# EAGLE board MSP-EXP432P401R_EagleCAD (EAGLE 7.2.0), part 1 of 2
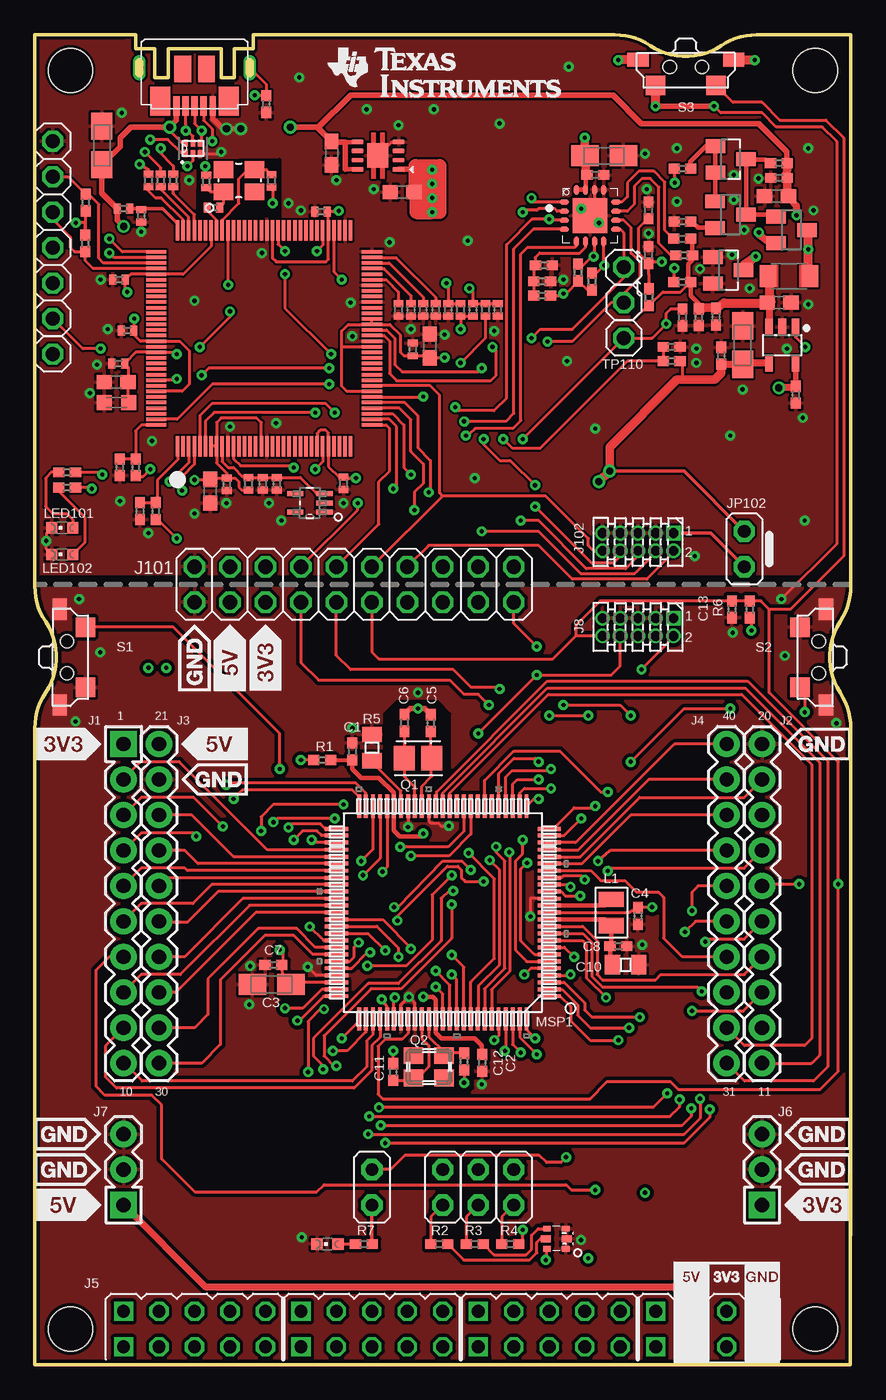
[diagram p6: board, top side]
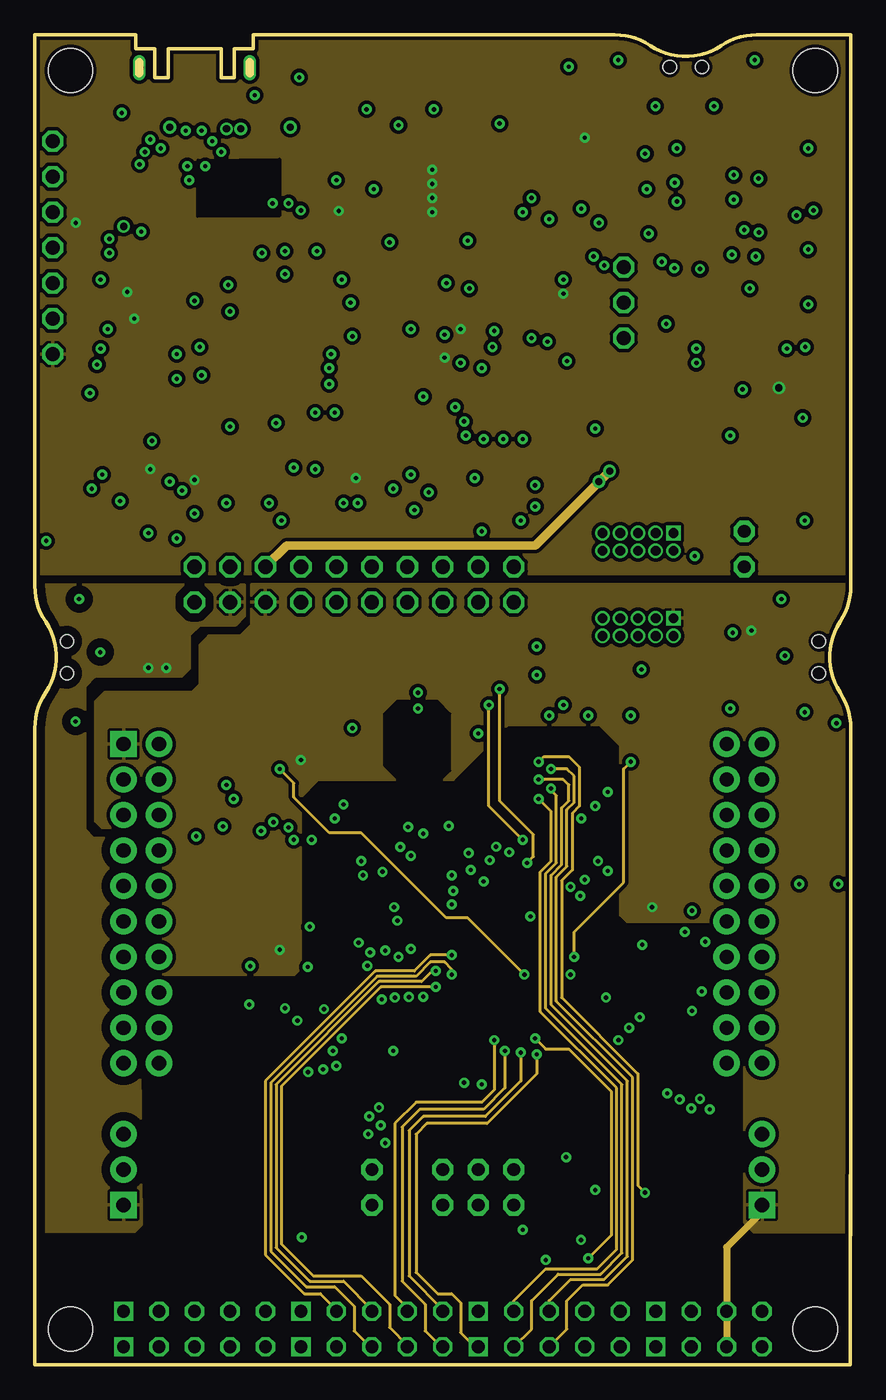
[diagram p7: board, inner layer Mid-Top]
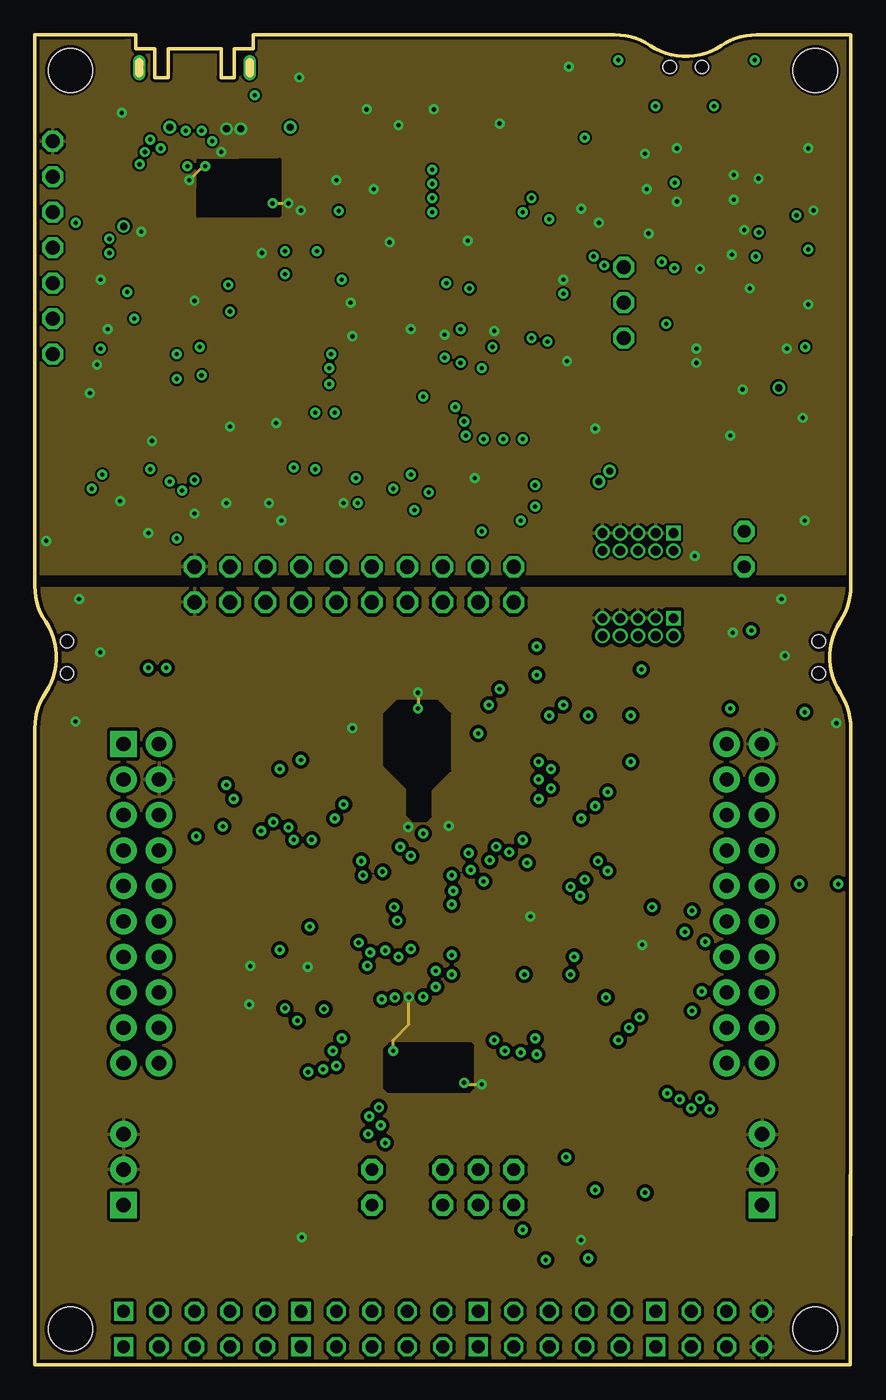
[diagram p8: board, inner layer Mid-Bottom]
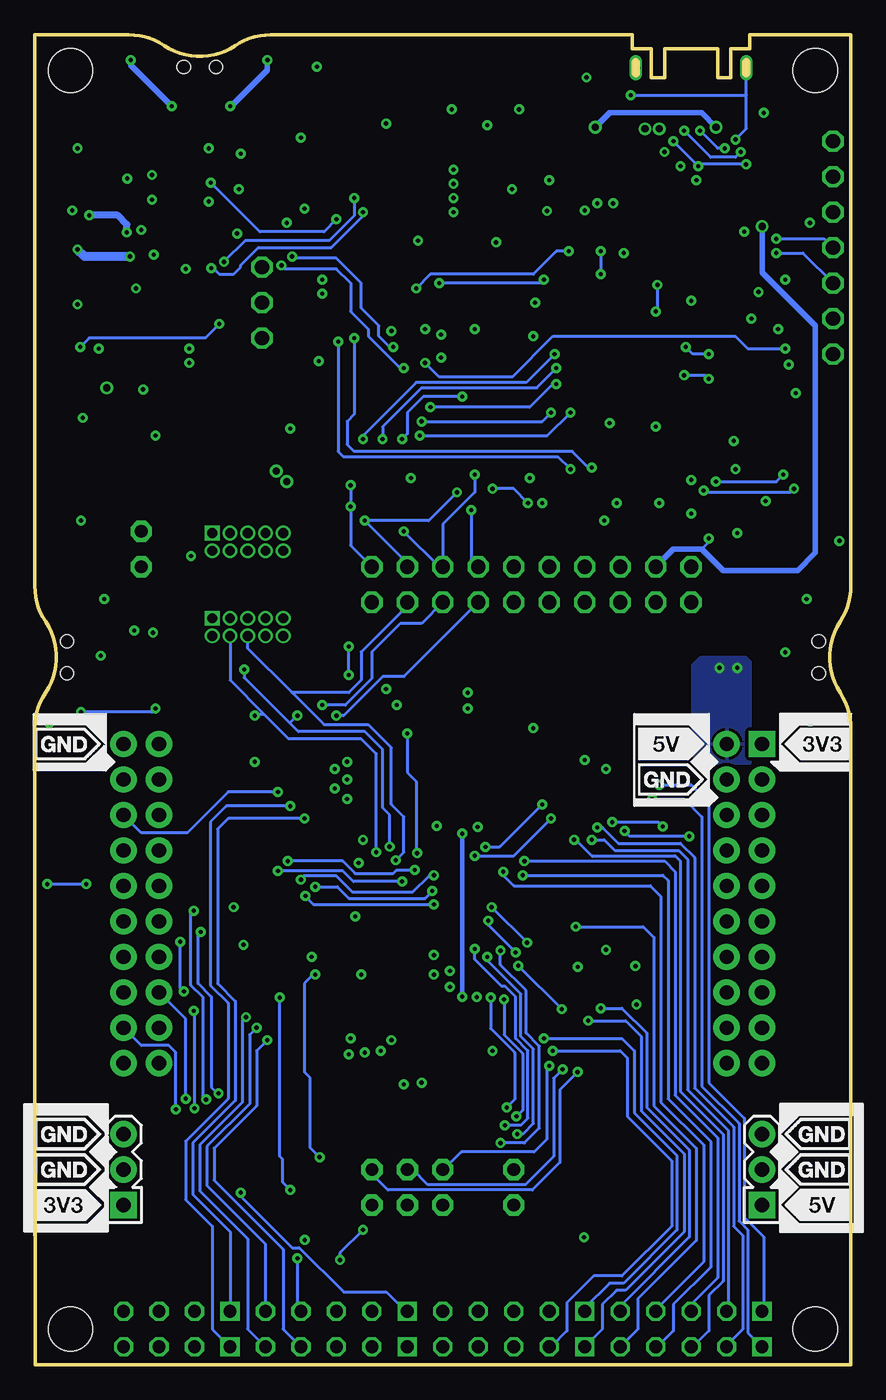
[diagram p9: board, bottom side, seen from below]

Size 58.42 x 95.25 mm. Coordinates in mm from the lower left corner, seen from the top.
Outline: 58.42,27.3 58.39,0 0,0 0,45.59 arc-33 0.76,48.13 arc67 0.76,53.21 arc-33 0,55.75 0,95.25 6.35,95.25
Outline: 58.42,9.27 58.42,45.59 arc33 57.66,48.13 arc-67 57.66,53.21 arc33 58.42,55.75 58.42,95.25 51.69,95.25 arc33 49.15,94.49 arc-67 44.07,94.49 arc33 41.53,95.25 16.51,95.25
Copper layers (1+2*15+16): Top 0.0178mm / dielectric 12mil / Mid-Top 0.0356mm / dielectric 27mil / Mid-Bottom 0.0356mm / dielectric 12mil / Bottom 0.0178mm
Design rules "MSP430 PCBExpress 4-layer-dietmar *": minimum track width 6mil, minimum drill 12mil, track to track 6mil, track to pad 6mil, pad to pad 6mil, via to via 8mil, smd to smd 6mil, copper to edge 8mil, drill to drill 8mil, minimum pad ring 0mil, minimum via ring 8mil, stop-mask expansion 8mil, vias tented up to drill 15mil, thermal gap 8mil
Net classes: 0 default: width 0.254 mm; 1 Ground: width 0.203 mm, drill 0.305 mm, clearance 0.152 mm to class 0, clearance 0.152 mm; 2 Power: width 0.203 mm, drill 0.305 mm, clearance 0.152 mm to class 0, clearance 0.152 mm to class 1, clearance 0.152 mm

## Footprints (pad centres in the part's own frame; a part is rotated, then mirrored left to right if it is on the bottom)
0402 = smd 0.8 x 0.7: 1 -0.6,0; 2 0.6,0
A/3216-18R = smd 1.95 x 1.5: + 1.375,0; - -1.375,0
CSMD0805 = smd 1.092 x 1.397: 1 -0.94,0; 2 0.94,0
C0402 = smd 0.5 x 0.7: 1 -0.45,0; 2 0.45,0
C0603 = smd 1.1 x 1: 1 -0.85,0; 2 0.85,0
C0603K = smd 1.05 x 1.08: 1 -0.875,0; 2 0.875,0
SOT23 = smd 1 x 1.4: 1 -0.95,-1.1; 2 0.95,-1.1; 3 0,1.1
SON8 = smd 0.85 x 0.35: 1 -1.475,0.975; 2 -1.475,0.325; 3 -1.475,-0.325; 4 -1.475,-0.975; 5 1.475,-0.975; 6 1.475,-0.325; 7 1.475,0.325; 8 1.475,0.975 | smd 1.5 x 1.75: 9 0,0
DRY6 = smd 0.559 x 0.305: 1 -0.356,0.508 | smd 0.508 x 0.305: 2 -0.381,0; 3 -0.381,-0.508; 4 0.381,-0.508; 5 0.381,0; 6 0.381,0.508
SOT23-5 = smd 0.55 x 1.2: 1 -1.204,-0.919; 2 -0.254,-0.919; 3 0.696,-0.919; 4 0.696,1.681; 5 -1.204,1.681
TQFP-128 = smd 1.45 x 0.25: P$1 0,0; P$2 0,-0.4; P$3 0,-0.8; P$4 0,-1.2; P$5 0,-1.6; P$6 0,-2; P$7 0,-2.4; P$8 0,-2.8; P$9 0,-3.2; P$10 0,-3.6; P$11 0,-4; P$12 0,-4.4; P$13 0,-4.8; P$14 0,-5.2; P$15 0,-5.6; P$16 0,-6; P$17 0,-6.4; P$18 0,-6.8; P$19 0,-7.2; P$20 0,-7.6; P$21 0,-8; P$22 0,-8.4; P$23 0,-8.8; P$24 0,-9.2; P$25 0,-9.6; P$26 0,-10; P$27 0,-10.4; P$28 0,-10.8; P$29 0,-11.2; P$30 0,-11.6; P$31 0,-12; P$32 0,-12.4; P$65 15.45,-12.4; P$66 15.45,-12; P$67 15.45,-11.6; P$68 15.45,-11.2; P$69 15.45,-10.8; P$70 15.45,-10.4; P$71 15.45,-10; P$72 15.45,-9.6; P$73 15.45,-9.2; P$74 15.45,-8.8; P$75 15.45,-8.4; P$76 15.45,-8; P$77 15.45,-7.6; P$78 15.45,-7.2; P$79 15.45,-6.8; P$80 15.45,-6.4; P$81 15.45,-6; P$82 15.45,-5.6; P$83 15.45,-5.2; P$84 15.45,-4.8; P$85 15.45,-4.4; P$86 15.45,-4; P$87 15.45,-3.6; P$88 15.45,-3.2; P$89 15.45,-2.8; P$90 15.45,-2.4; P$91 15.45,-2; P$92 15.45,-1.6; P$93 15.45,-1.2; P$94 15.45,-0.8; P$95 15.45,-0.4; P$96 15.45,0 | smd 0.25 x 1.45: P$33 1.525,-13.925; P$34 1.925,-13.925; P$35 2.325,-13.925; P$36 2.725,-13.925; P$37 3.125,-13.925; P$38 3.525,-13.925; P$39 3.925,-13.925; P$40 4.325,-13.925; P$41 4.725,-13.925; P$42 5.125,-13.925; P$43 5.525,-13.925; P$44 5.925,-13.925; P$45 6.325,-13.925; P$46 6.725,-13.925; P$47 7.125,-13.925; P$48 7.525,-13.925; P$49 7.925,-13.925; P$50 8.325,-13.925; P$51 8.725,-13.925; P$52 9.125,-13.925; P$53 9.525,-13.925; P$54 9.925,-13.925; P$55 10.325,-13.925; P$56 10.725,-13.925; P$57 11.125,-13.925; P$58 11.525,-13.925; P$59 11.925,-13.925; P$60 12.325,-13.925; P$61 12.725,-13.925; P$62 13.125,-13.925; P$63 13.525,-13.925; P$64 13.925,-13.925; P$97 13.925,1.525; P$98 13.525,1.525; P$99 13.125,1.525; P$100 12.725,1.525; P$101 12.325,1.525; P$102 11.925,1.525; P$103 11.525,1.525; P$104 11.125,1.525; P$105 10.725,1.525; P$106 10.325,1.525; P$107 9.925,1.525; P$108 9.525,1.525; P$109 9.125,1.525; P$110 8.725,1.525; P$111 8.325,1.525; P$112 7.925,1.525; P$113 7.525,1.525; P$114 7.125,1.525; P$115 6.725,1.525; P$116 6.325,1.525; P$117 5.925,1.525; P$118 5.525,1.525; P$119 5.125,1.525; P$120 4.725,1.525; P$121 4.325,1.525; P$122 3.925,1.525; P$123 3.525,1.525; P$124 3.125,1.525; P$125 2.725,1.525; P$126 2.325,1.525; P$127 1.925,1.525; P$128 1.525,1.525
DCK5 = smd 1.168 x 0.356: 1 -1.041,0.66; 2 -1.041,0; 3 -1.041,-0.66; 4 1.041,-0.66; 5 1.041,0.66
J1 = drill 1.016 pad 1.88 square: 1 0,22.86 | drill 1.016 pad 1.88: 2 0,20.32; 3 0,17.78; 4 0,15.24; 5 0,12.7; 6 0,10.16; 7 0,7.62; 8 0,5.08; 9 0,2.54; 10 0,0
J2 = drill 1.016 pad 1.88: 11 0,0; 12 0,2.54; 13 0,5.08; 14 0,7.62; 15 0,10.16; 16 0,12.7; 17 0,15.24; 18 0,17.78; 19 0,20.32; 20 0,22.86
J3 = drill 1.016 pad 1.88: 21 0,22.86; 22 0,20.32; 23 0,17.78; 24 0,15.24; 25 0,12.7; 26 0,10.16; 27 0,7.62; 28 0,5.08; 29 0,2.54; 30 0,0
J4 = drill 1.016 pad 1.88: 31 0,0; 32 0,2.54; 33 0,5.08; 34 0,7.62; 35 0,10.16; 36 0,12.7; 37 0,15.24; 38 0,17.78; 39 0,20.32; 40 0,22.86
BOTTOM_CONNECTOR = drill 0.914 square: 1 -24.13,-1.27; 2 -24.13,1.27; 11 -11.43,-1.27; 12 -11.43,1.27; 21 1.27,-1.27; 22 1.27,1.27; 31 13.97,-1.27; 32 13.97,1.27 | drill 0.914 octagon: 3 -21.59,-1.27; 4 -21.59,1.27; 5 -19.05,-1.27; 6 -19.05,1.27; 7 -16.51,-1.27; 8 -16.51,1.27; 9 -13.97,-1.27; 10 -13.97,1.27; 13 -8.89,-1.27; 14 -8.89,1.27; 15 -6.35,-1.27; 16 -6.35,1.27; 17 -3.81,-1.27; 18 -3.81,1.27; 19 -1.27,-1.27; 20 -1.27,1.27; 23 3.81,-1.27; 24 3.81,1.27; 25 6.35,-1.27; 26 6.35,1.27; 27 8.89,-1.27; 28 8.89,1.27; 29 11.43,-1.27; 30 11.43,1.27; 33 16.51,-1.27; 34 16.51,1.27; 35 19.05,-1.27; 36 19.05,1.27; 37 21.59,-1.27; 38 21.59,1.27
3PIN_PWR_3V3 = drill 1.016 pad 1.88 square: 1 0,0 | drill 1.016 pad 1.88: 2 0,2.54; 3 0,5.08
3PIN_PWR_5V = drill 1.016 pad 1.88 square: 1 0,0 | drill 1.016 pad 1.88: 2 0,2.54; 3 0,5.08
ARM-10 = drill 0.7 pad 0.95 square: 1 -2.54,-0.635 | drill 0.7 pad 0.95: 2 -2.54,0.635; 3 -1.27,-0.635; 4 -1.27,0.635; 5 0,-0.635; 6 0,0.635; 7 1.27,-0.635; 8 1.27,0.635; 9 2.54,-0.635; 10 2.54,0.635
J101_432 = drill 1.016 octagon: 1 -11.43,-1.27; 2 -11.43,1.27; 3 -8.89,-1.27; 4 -8.89,1.27; 5 -6.35,-1.27; 6 -6.35,1.27; 7 -3.81,-1.27; 8 -3.81,1.27; 9 -1.27,-1.27; 10 -1.27,1.27; 11 1.27,-1.27; 12 1.27,1.27; 13 3.81,-1.27; 14 3.81,1.27; 15 6.35,-1.27; 16 6.35,1.27; 17 8.89,-1.27; 18 8.89,1.27; 19 11.43,-1.27; 20 11.43,1.27
JP1M = drill 0.914 pad 1.524 octagon: 1 0,-1.27; 2 0,1.27
0806 = smd 1.1 x 1.8: 1 -0.94,0; 2 0.94,0
L3216C = smd 1.2 x 1.6: 1 -1.5,0; 2 1.5,0
CHIPLED_0603 = smd 0.8 x 0.8: A 0,-0.75; C 0,0.75
RGB_LED = smd 0.55 x 0.4: 1 -0.675,0.725; 3 -0.675,-0.725; 4 0.675,0.725; 6 0.675,-0.725 | smd 0.7 x 0.5: 2 -0.75,0; 5 0.75,0
PZ100 = smd 1.676 x 0.279: 1 -7.62,5.994; 2 -7.62,5.512; 3 -7.62,5.004; 4 -7.62,4.496; 5 -7.62,3.988; 6 -7.62,3.505; 7 -7.62,2.997; 8 -7.62,2.489; 9 -7.62,2.007; 10 -7.62,1.499; 11 -7.62,0.991; 12 -7.62,0.508; 13 -7.62,0; 14 -7.62,-0.508; 15 -7.62,-0.991; 16 -7.62,-1.499; 17 -7.62,-2.007; 18 -7.62,-2.489; 19 -7.62,-2.997; 20 -7.62,-3.505; 21 -7.62,-3.988; 22 -7.62,-4.496; 23 -7.62,-5.004; 24 -7.62,-5.512; 25 -7.62,-5.994; 51 7.62,-5.994; 52 7.62,-5.512; 53 7.62,-5.004; 54 7.62,-4.496; 55 7.62,-3.988; 56 7.62,-3.505; 57 7.62,-2.997; 58 7.62,-2.489; 59 7.62,-2.007; 60 7.62,-1.499; 61 7.62,-0.991; 62 7.62,-0.508; 63 7.62,0; 64 7.62,0.508; 65 7.62,0.991; 66 7.62,1.499; 67 7.62,2.007; 68 7.62,2.489; 69 7.62,2.997; 70 7.62,3.505; 71 7.62,3.988; 72 7.62,4.496; 73 7.62,5.004; 74 7.62,5.512; 75 7.62,5.994 | smd 0.279 x 1.676: 26 -5.994,-7.62; 27 -5.512,-7.62; 28 -5.004,-7.62; 29 -4.496,-7.62; 30 -3.988,-7.62; 31 -3.505,-7.62; 32 -2.997,-7.62; 33 -2.489,-7.62; 34 -2.007,-7.62; 35 -1.499,-7.62; 36 -0.991,-7.62; 37 -0.508,-7.62; 38 0,-7.62; 39 0.508,-7.62; 40 0.991,-7.62; 41 1.499,-7.62; 42 2.007,-7.62; 43 2.489,-7.62; 44 2.997,-7.62; 45 3.505,-7.62; 46 3.988,-7.62; 47 4.496,-7.62; 48 5.004,-7.62; 49 5.512,-7.62; 50 5.994,-7.62; 76 5.994,7.62; 77 5.512,7.62; 78 5.004,7.62; 79 4.496,7.62; 80 3.988,7.62; 81 3.505,7.62; 82 2.997,7.62; 83 2.489,7.62; 84 2.007,7.62; 85 1.499,7.62; 86 0.991,7.62; 87 0.508,7.62; 88 0,7.62; 89 -0.508,7.62; 90 -0.991,7.62; 91 -1.499,7.62; 92 -2.007,7.62; 93 -2.489,7.62; 94 -2.997,7.62; 95 -3.505,7.62; 96 -3.988,7.62; 97 -4.496,7.62; 98 -5.004,7.62; 99 -5.512,7.62; 100 -5.994,7.62
RSA16 = smd 0.7 x 0.35: 1 -1.85,0.975; 2 -1.85,0.325; 3 -1.85,-0.325; 4 -1.85,-0.975; 9 1.85,-0.975; 10 1.85,-0.325; 11 1.85,0.325; 12 1.85,0.975 | smd 0.35 x 0.7: 5 -0.975,-1.85; 6 -0.325,-1.85; 7 0.325,-1.85; 8 0.975,-1.85; 13 0.975,1.85; 14 0.325,1.85; 15 -0.325,1.85; 16 -0.975,1.85 | smd 2.5 x 2.5: TP 0,0
LF_XTAL = smd 1.75 x 1.5: 1 0,1; 2 0,-1
FA-238 = smd 1.4 x 1.2: 1 -1.1,-0.8; 2 1.1,-0.8; 3 1.1,0.8; 4 -1.1,0.8
NX3225GA = smd 1.4 x 1.2: 1 0,0; 2 2.2,0; 3 2.2,1.6; 4 0,1.6
0805 = smd 1.092 x 1.397: 1 -0.94,0; 2 0.94,0
R0402 = smd 0.5 x 0.7: 1 -0.45,0; 2 0.45,0
TS-1188E = smd 1.524 x 1.016: G1 -3.429,-0.508; G2 3.429,-0.508 | smd 1.397 x 1.397: S1 -2.159,1.333; S2 2.159,1.333 | hole 0.95: -1.15,0; 1.15,0
SOT23-BEC = smd 1 x 1.4: B -0.95,-1.1; C 0,1.1; E 0.95,-1.1
1X01 = drill 1.016 octagon: 1 0,0
MOUNTHOLE_125MIL = hole 3.175: 0,0
MOLEX_105164-0001 = smd 0.45 x 1.4: D+ 0,-4.1; D- -0.65,-4.1; GND 1.3,-4.1; ID 0.65,-4.1; VBUS -1.3,-4.1 | smd 1.45 x 2.1: SHIELD1 -2.45,-3.75; SHIELD4 2.45,-3.75 | smd 1.2 x 1.9: SHIELD2 -0.85,-1.45; SHIELD3 0.85,-1.45 | drill 0.6 long: SHIELD_TH1 -3.95,-1.35; SHIELD_TH2 3.95,-1.35

## Placement (x,y rotation side)
C1  100n  [0402]  22.73,43.92 90 top
C2  100n  [0402]  32.03,21.62 270 top
C3  10u  [A/3216-18R]  16.95,27.24 0 top
C4  100n  [0402]  43.18,32.13 270 top
C5  22p  [0402]  28.35,45.95 90 top
C6  22p  [0402]  26.47,45.97 90 top
C7  100n  [0402]  17.08,28.64 180 top
C8  100n  [0402]  41.78,29.97 0 top
C10  4u7  [CSMD0805]  42.29,28.64 0 top
C11  22p  [0402]  25.65,20.96 90 top
C12  22p  [0402]  30.73,21.72 270 top
C13  1n  [0402]  49.91,54.1 270 top
C101  12pF  [C0402]  12.27,84.76 90 top
C102  12pF  [C0402]  16.94,84.79 270 top
C103  0.1uF  [C0402]  29.59,75.56 270 top
C104  10n  [C0402]  13.74,63.04 270 top
C105  2u2  [C0603]  26.29,83.98 180 top
C106  4.7u  [A/3216-18R]  40.77,86.58 180 top
C107  1u  [C0603]  12.55,62.56 270 top
C108  DNP  [C0402]  33.15,75.56 270 top
C110  10n  [C0402]  17.32,63.09 270 top
C111  100n  [C0402]  16.31,63.09 270 top
C112  10n  [C0402]  22.1,63.12 270 top
C113  100n  [C0402]  27.05,72.71 90 top
C114  10n  [C0402]  6.62,74.07 180 top
C115  33p  [0402]  43.94,82.68 270 top
C116  33p  [0402]  36.45,78.74 180 top
C117  4.7u  [C0603]  53.1,83.7 180 top
C118  100n  [0402]  53.28,85 180 top
C119  4.7u  [C0603]  53.29,76.06 0 top
C120  100n  [0402]  47.53,75.03 270 top
C121  100n  [C0402]  20.47,82.58 180 top
C123  10n  [C0402]  6.03,77.72 180 top
C124  100n  [0402]  40.13,85.22 0 top
C126  220n  [0402]  54.48,69.47 270 top
C127  220n  [0402]  48.77,75.06 270 top
C128  47u  [A/3216-18R]  50.67,73.03 270 top
C129  100n  [0402]  49.15,72.26 90 top
C130  1u  [C0603]  28.26,72.96 270 top
C131  0.1uF  [C0402]  5.97,71.7 180 top
C132  1u  [C0603]  5.82,70.38 0 top
C133  2.2uF  [C0603K]  5.84,68.91 180 top
C140  4.7u  [A/3216-18R]  4.8,87.33 270 top
C141  1u  [C0603]  21.24,86.78 270 top
C150  0.1uF  [C0402]  7.62,82.3 270 top
D101  BAS40-05  [SOT23]  49.82,86.34 270 top
D102  BAS40-05  [SOT23]  49.65,78.39 270 top
DRAW3  [LOGO-ROCKET-10X7MM-BRD]  10.51,9.35 7 top
IC101  TPS73533DRB  [SON8]  24.56,86.6 180 top
IC102  TPD4E004_DRY_6  [DRY6]  11.32,87.12 90 top
IC103  TPS2102DBV  [SOT23-5]  53.26,73.41 180 top
IC106  TM4C129ENCPDT  [TQFP-128]  10.21,65.79 90 top
IC107  LM4040B25_DCK_5  [DCK5]  19.68,61.72 180 top
J1  BP_HEADERS_J1  [J1]  6.35,21.59 0 top
J2  BP_HEADERS_J2  [J2]  52.07,21.59 0 top
J3  BP_HEADERS_J3  [J3]  8.89,21.59 0 top
J4  BP_HEADERS_J4  [J4]  49.53,21.59 0 top
J5  EDGE_CON  [BOTTOM_CONNECTOR]  30.48,2.54 0 top
J6  HEADER 1X03  [3PIN_PWR_3V3]  52.07,11.43 0 top
J7  BP_HEADERS_PWR_5V  [3PIN_PWR_5V]  6.35,11.43 0 top
J8  [ARM-10]  43.18,52.83 180 top
J101  J101_432  [J101_432]  22.86,55.88 0 top
J102  [ARM-10]  43.18,58.93 180 top
JP8  LED1  [JP1M]  24.13,12.7 180 top
JP9  LED2_RED  [JP1M]  29.21,12.7 180 top
JP10  LED2_GREEN  [JP1M]  31.75,12.7 180 top
JP11  LED2_BLUE  [JP1M]  34.29,12.7 180 top
JP102  [JP1M]  50.8,58.42 180 top
L1  4.7uH  [0806]  41.27,32.38 90 top
L101  2u2  [L3216C]  53.99,77.97 180 top
LED1  [CHIPLED_0603]  20.96,8.64 90 top
LED2  EVERLIGHT_19-337  [RGB_LED]  37.34,9.02 180 top
LED101  [CHIPLED_0603]  1.97,59.94 90 top
LED102  [CHIPLED_0603]  1.97,58.03 90 top
MSP1  MSP432  [PZ100]  29.21,32.38 180 top
MSP101  MSP430G2452IRSA16R  [RSA16]  39.75,82.3 0 top
Q1  [LF_XTAL]  27.43,43.43 90 top
Q2  [FA-238]  28.19,21.34 180 top
Q101  NX3225GA_OSC  [NX3225GA]  13.51,84 0 top
R1  0R  [0402]  20.57,43.31 0 top
R2  110R  [0402]  28.96,8.64 0 top
R3  16R  [0402]  31.5,8.64 0 top
R4  24R  [0402]  34.04,8.64 0 top
R5  91kOhm, 0.1%, 25ppm/C  [0805]  24.13,44.2 90 top
R6  47k  [0402]  51.18,54.1 270 top
R7  470  [0402]  23.56,8.64 180 top
R101  DNP  [0402]  45.59,72.9 180 top
R102  100  [R0402]  32.26,75.56 90 top
R103  10k  [R0402]  31.37,75.56 90 top
R104  51  [R0402]  30.48,75.56 90 top
R105  1k 1%  [R0402]  15.29,63.09 270 top
R106  2R  [R0402]  12.78,82.88 180 top
R107  47k  [0402]  46.37,75.01 270 top
R108  1k  [R0402]  28.7,75.56 90 top
R109  1k  [R0402]  27.81,75.56 90 top
R110  1k  [R0402]  26.92,75.56 90 top
R111  470  [0402]  2.31,63.92 180 top
R112  220k  [0402]  43.97,76.45 90 top
R113  220k  [0402]  43.95,79.48 90 top
R114  220k  [0402]  36.32,76.58 180 top
R115  220k  [0402]  36.32,77.6 0 top
R116  4k7  [0402]  39.89,77.58 90 top
R117  4k7  [0402]  38.9,78.22 90 top
R118  820  [0402]  46.37,85.66 180 top
R119  0  [0402]  46.37,81.88 180 top
R120  470  [0402]  53.28,86.07 180 top
R123  33  [0402]  16.56,90.29 270 top
R124  470  [0402]  2.31,62.83 180 top
R125  10k  [0402]  3.63,83.24 270 top
R126  2k2  [0402]  46.35,80.64 180 top
R127  3k3  [0402]  46.35,77.55 180 top
R128  6k8  [0402]  46.48,79.45 180 top
R129  10k  [0402]  3.61,80.31 90 top
R131  0  [R0402]  8.13,84.84 270 top
R132  330k  [0402]  8.66,61.14 90 top
R133  220k  [0402]  7.52,61.14 90 top
R134  DNP  [0402]  45.59,71.88 180 top
R135  220k  [0402]  7.21,64.27 90 top
R136  220k  [0402]  6.07,64.27 90 top
R137  0  [R0402]  9.02,84.84 270 top
R138  0  [R0402]  9.91,84.84 270 top
R139  dnp  [R0402]  26.04,75.56 90 top
R140  51  [R0402]  6.35,82.8 0 top
S1  [TS-1188E]  2.29,50.67 270 top
S2  [TS-1188E]  56.13,50.67 90 top
S3  [TS-1188E]  46.61,92.96 180 top
T101  DMG1013UW  [SOT23]  54.17,81.27 270 top
T102  BC850CW-115  [SOT23-BEC]  49.81,82.37 270 top
TP101  TEST_PIN2  [1X01]  1.27,87.63 270 top
TP102  TEST_PIN2  [1X01]  1.27,85.09 270 top
TP103  TEST_PIN2  [1X01]  1.27,82.55 270 top
TP104  TEST_PIN2  [1X01]  1.27,80.01 270 top
TP105  TEST_PIN2  [1X01]  1.27,77.47 270 top
TP106  TEST_PIN2  [1X01]  1.27,74.93 270 top
TP107  TEST_PIN2  [1X01]  1.27,72.39 0 top
TP108  TEST_PIN2  [1X01]  42.16,78.61 0 top
TP109  TEST_PIN2  [1X01]  42.16,76.07 0 top
TP110  TEST_PIN2  [1X01]  42.16,73.53 0 top
U$1  MOUNTHOLE_125MIL  [MOUNTHOLE_125MIL]  2.54,2.54 0 top
U$2  MOUNTHOLE_125MIL  [MOUNTHOLE_125MIL]  55.88,2.54 0 top
U$3  MOUNTHOLE_125MIL  [MOUNTHOLE_125MIL]  2.54,92.71 0 top
U$4  [LOGO16_TPLACE]  20.89,90.63 0 top
U$5  MOUNTHOLE_125MIL  [MOUNTHOLE_125MIL]  55.88,92.71 0 top
U$6  SILK_HEADER_LABEL  [SILK_HEADER_LABEL]  45.77,0 0 top
U$7  MIKE_TM  [MIKE_TM]  29.21,31.11 0 top
U$8  P401R_REARSILK_REV2_0  [P401R_REARSILK_REV2_0]  0,0 0 top
U$9  BP_3PIN_SILK  [3PIN_PWR_SILK]  53.21,9.53 0 top
U$10  BP_3PIN_SILK_RT  [3PIN_PWR_SILK_RT]  5.08,9.53 0 top
USB101  [MOLEX_105164-0001]  11.43,94.25 0 top